# EasyEDA Pro project 贴片练习PCB.epro, board PCB2
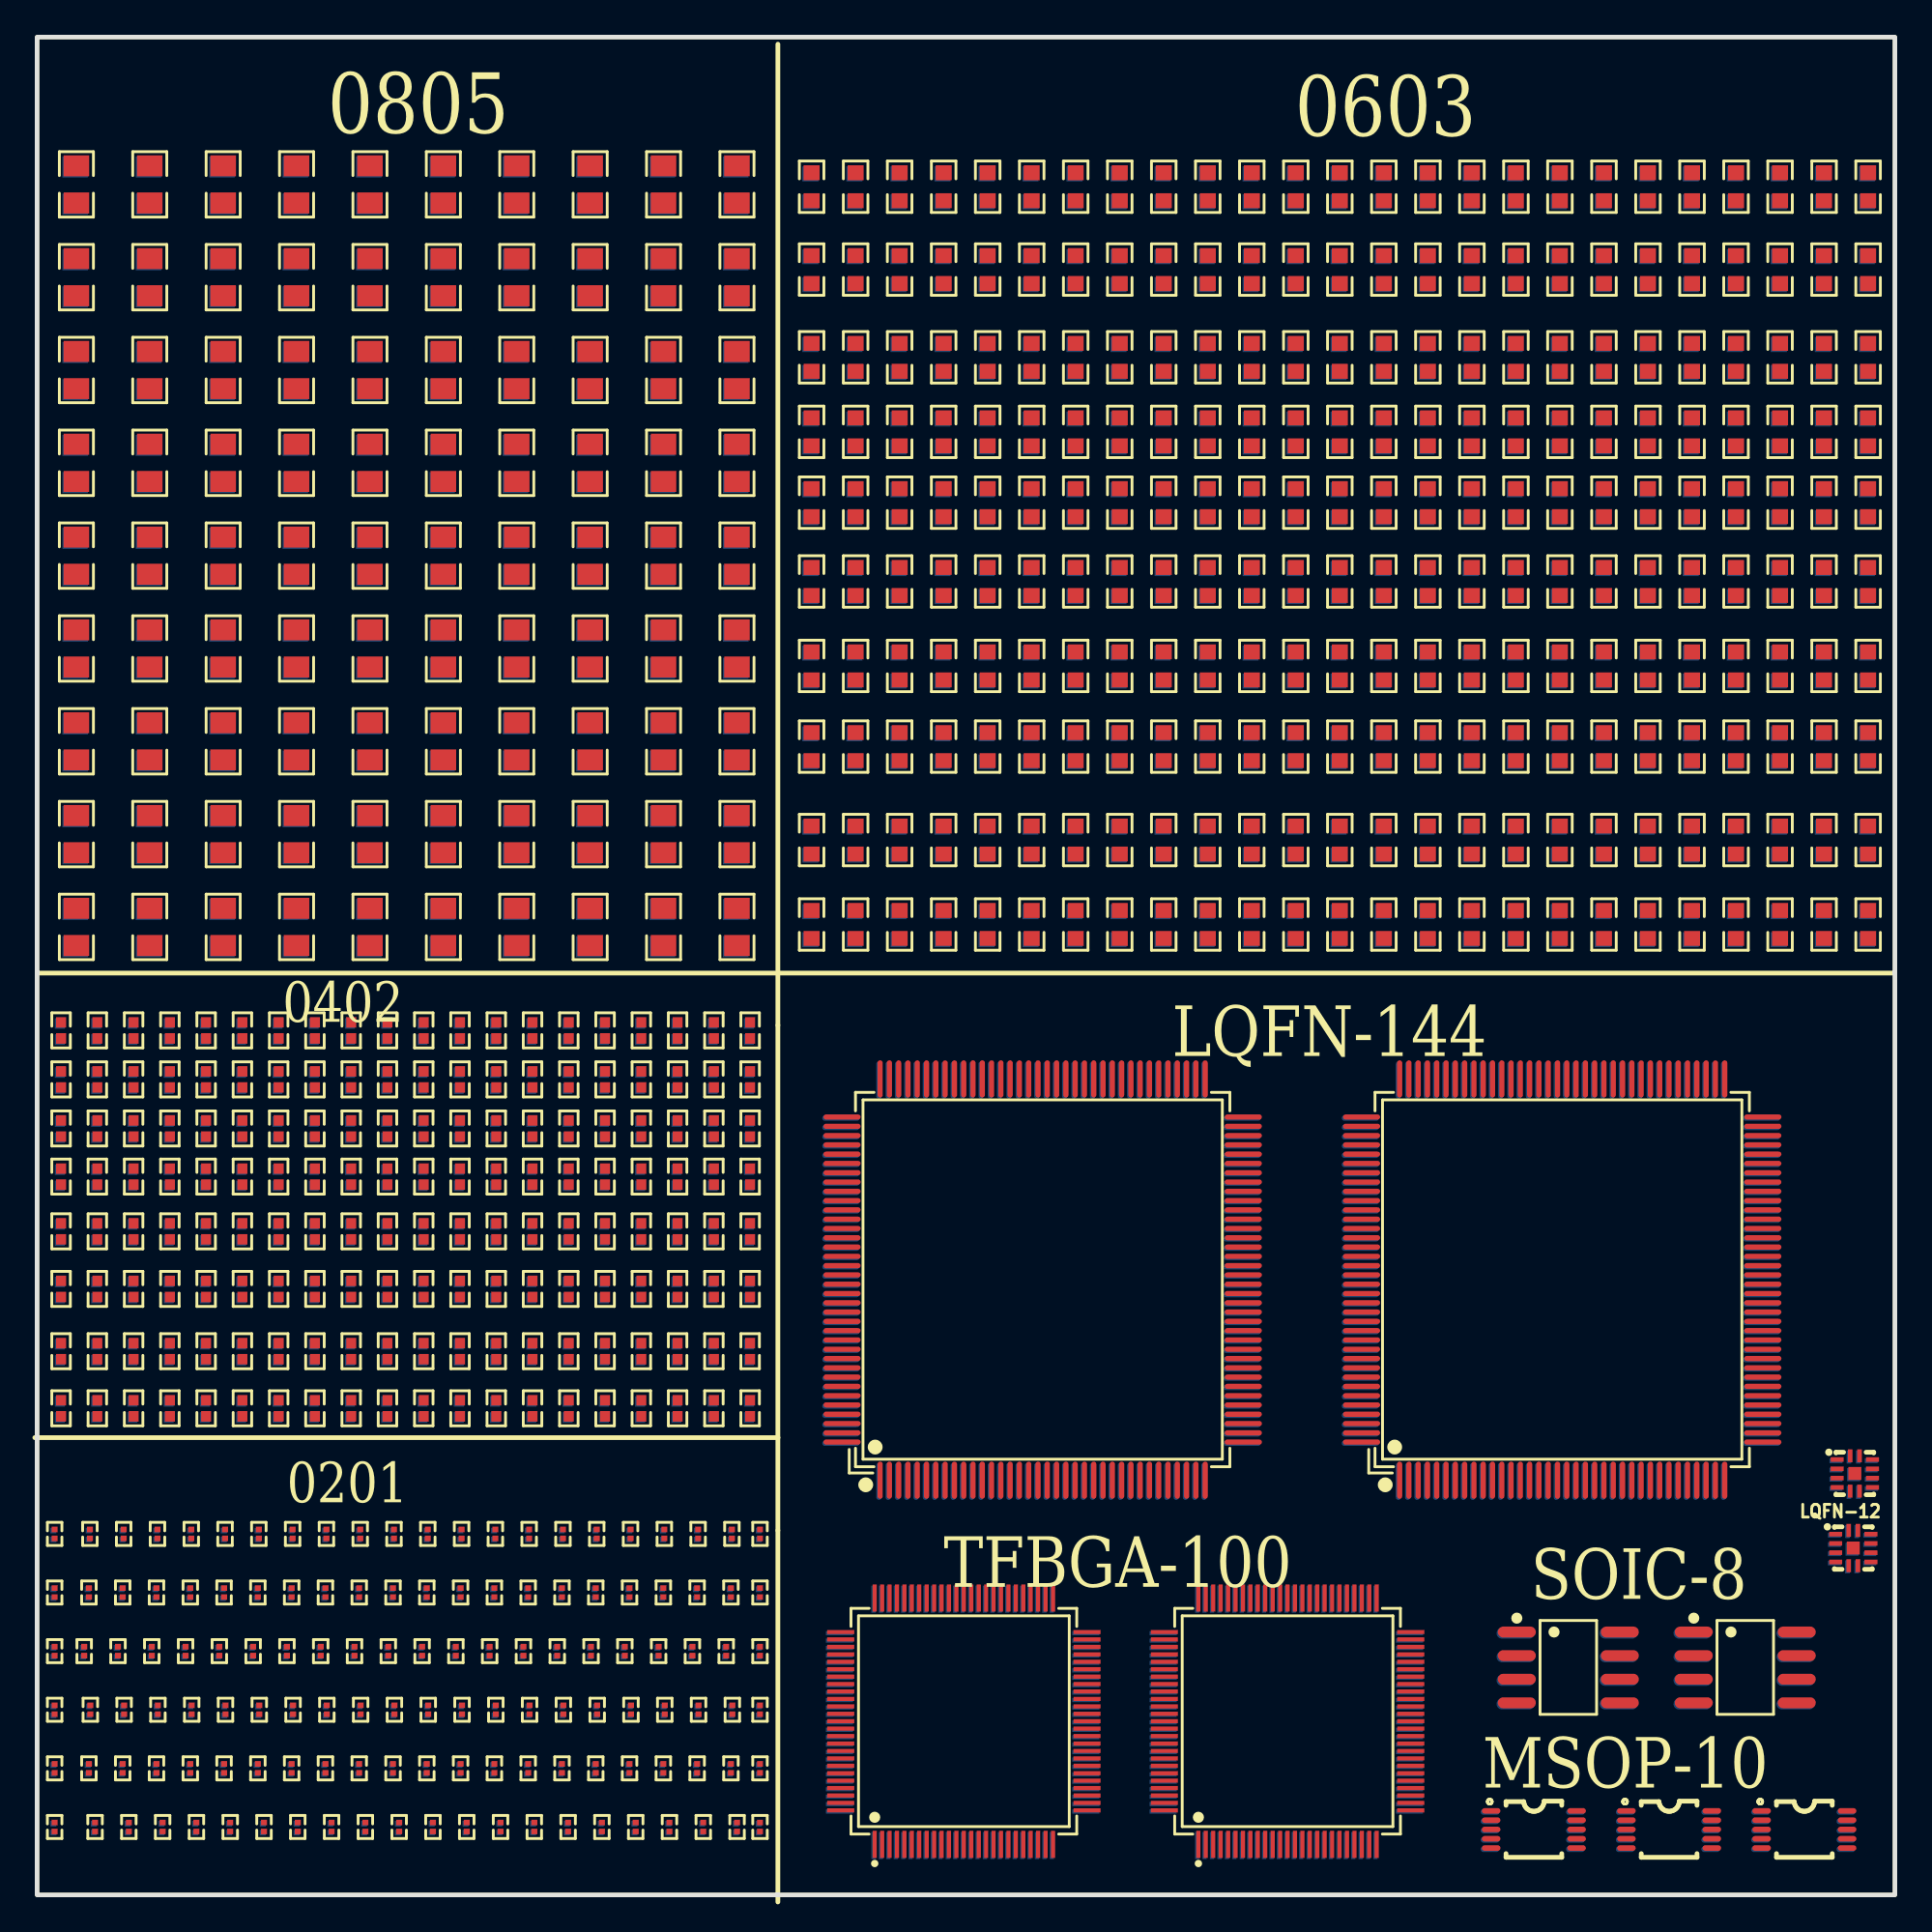
[diagram p1: board, top side]
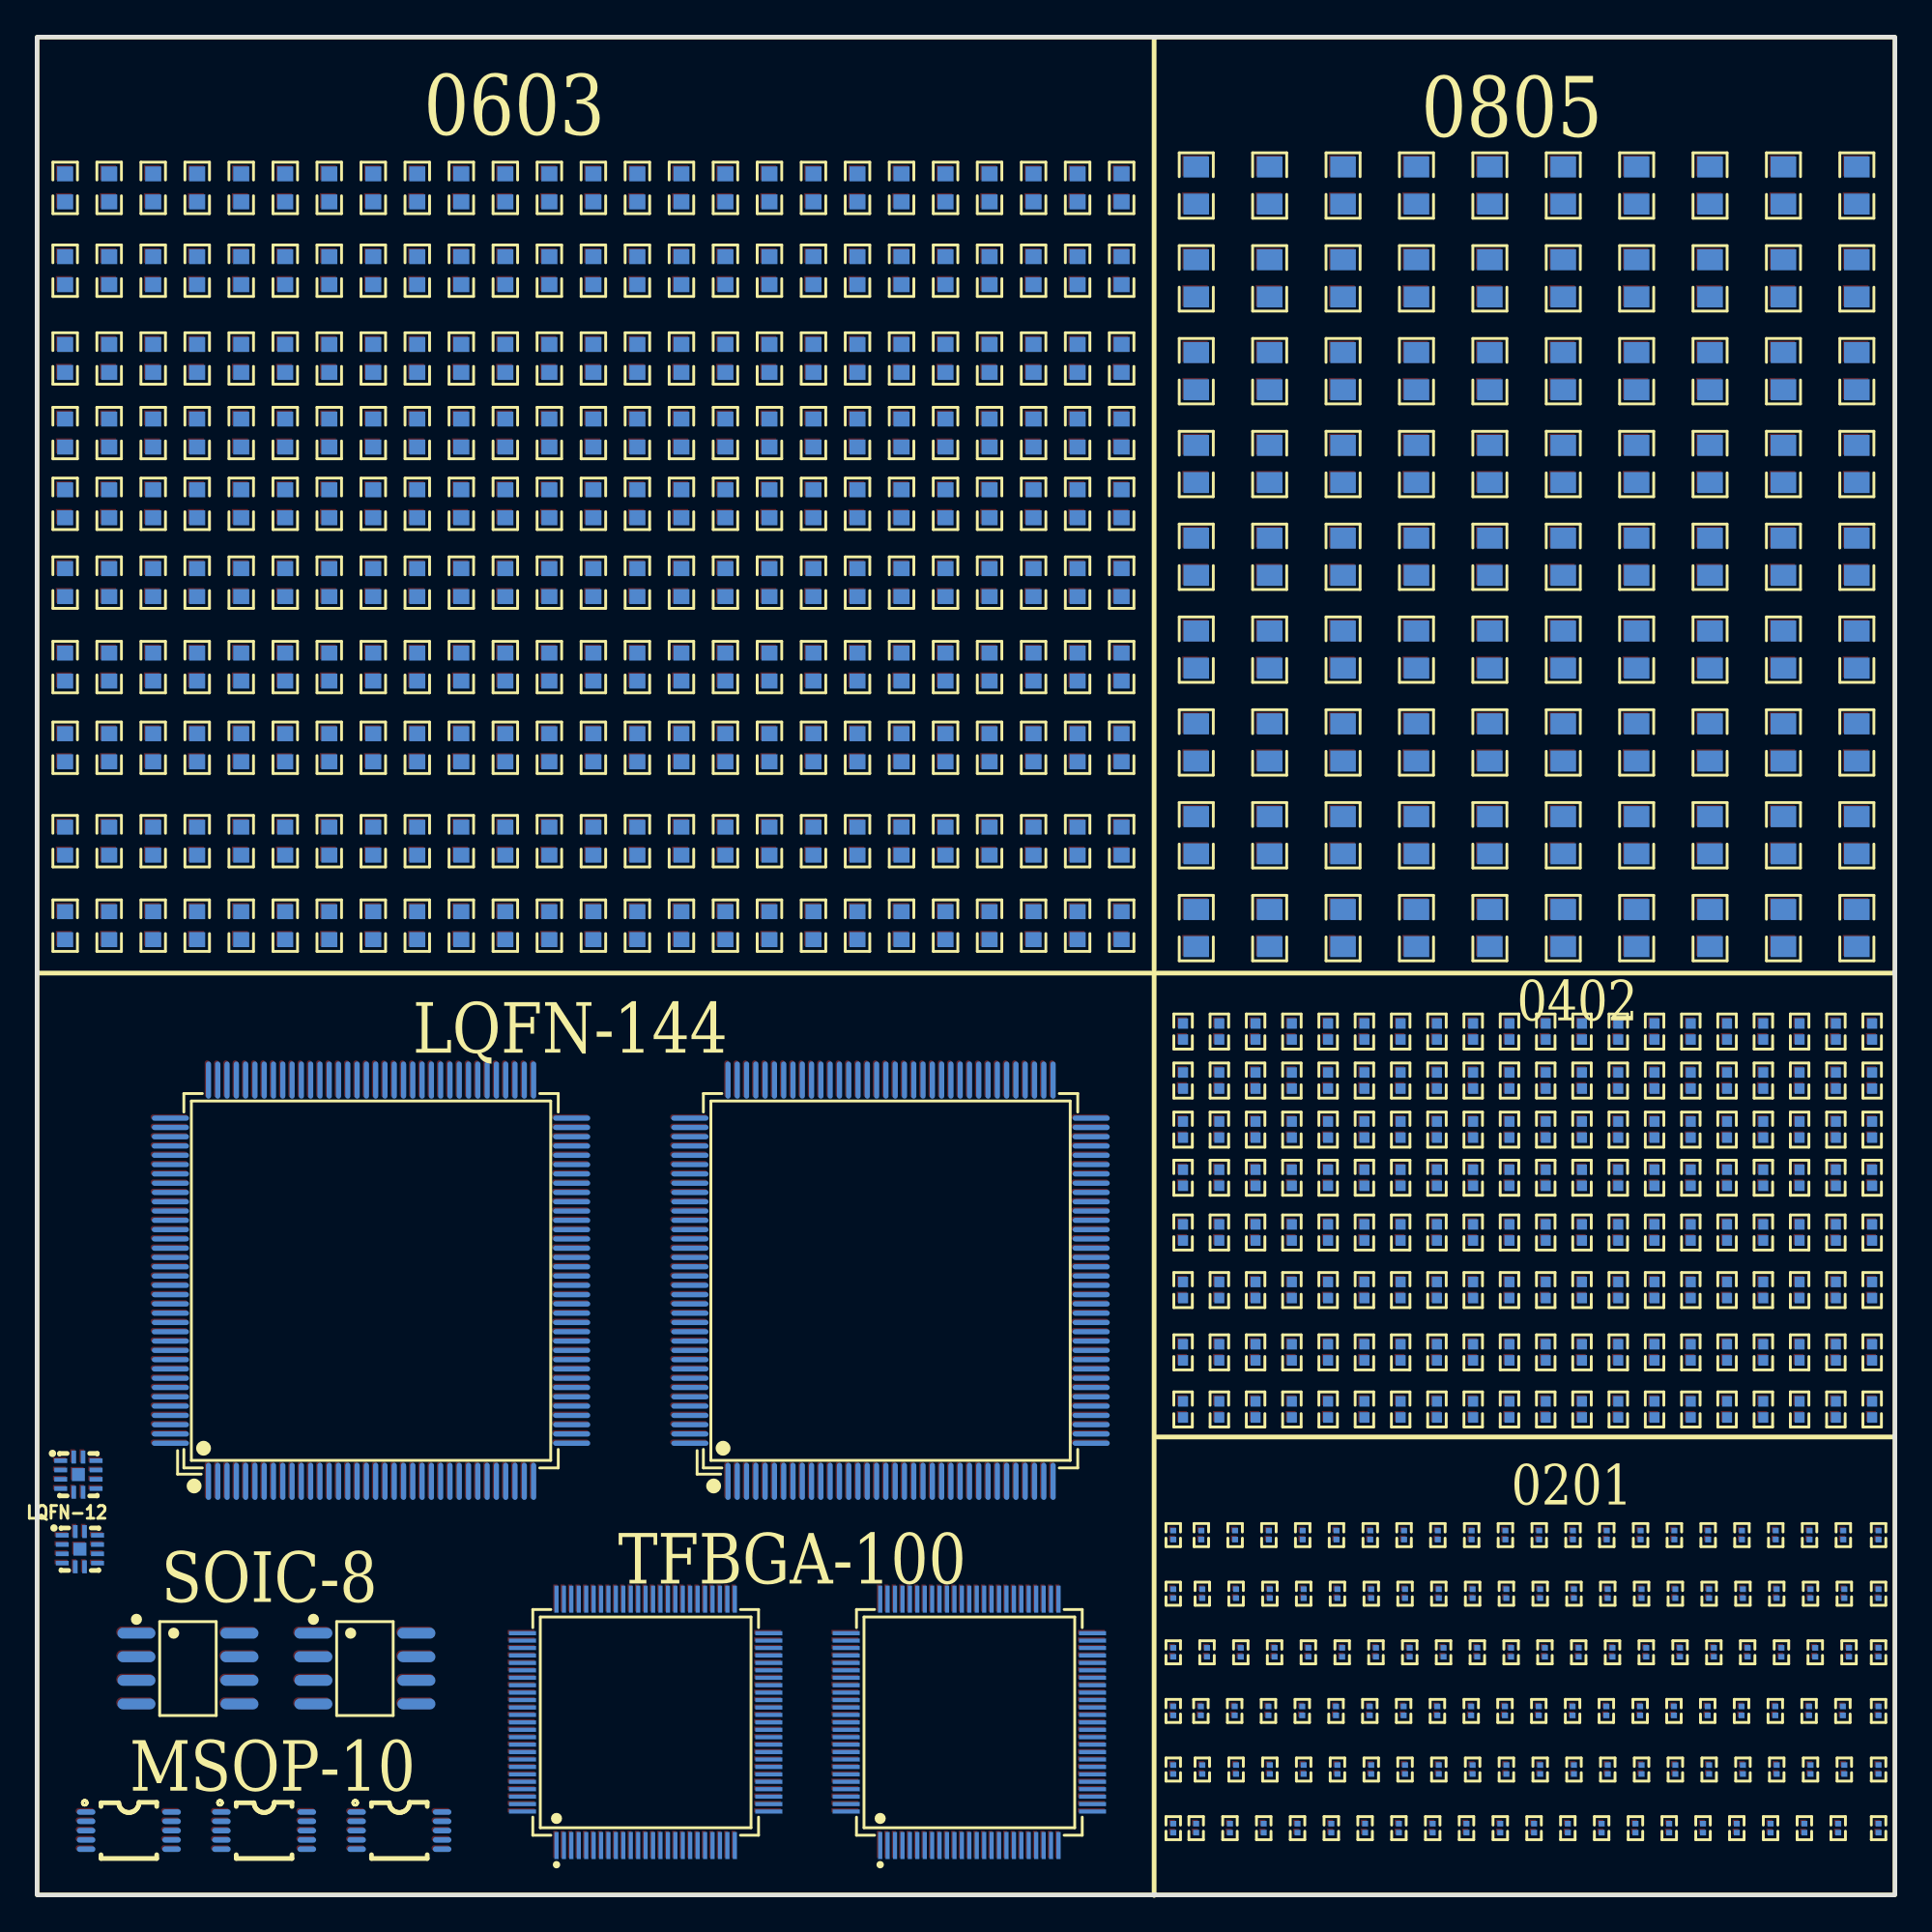
[diagram p2: board, bottom side, seen from below]

Outline 100 x 100 mm; copper layers: Top Layer, Bottom Layer. Coordinates in mm from the lower left corner of the outline.
Outline path: rectangle 0,100 100,0
Stack: Top Layer 0.035mm / Dielectric1 1.51mm FR4 er 4.5 / Bottom Layer 0.035mm

## Design rules (mm)
template: JLCPCB Capability(Two Layers Board)
spacing copperThickness1oz (default): track to track 0.102, other pairs 0.152 to 0.3
spacing copperThickness2oz: track to track 0.203, other pairs 0.152 to 0.3
track width copperThickness1oz (default): min 0.127, default 0.254, max 2.54
track width copperThickness2oz: min 0.203, default 0.254, max 2.54
differential pair differentialPair (default): width min 0.127, default 0.254, max 2.54; gap min 0.152, default 0.152
via viaSize (default): diameter min 0.5, default 0.61, max 10; hole min 0.3, default 0.305, max 6.3

## Placement (name value [footprint] x y rotation side)
LQFN-12  -  [LQFN-12_L2.0-W2.0-P0.50-TL-EP0.7]  97.85 22.68 0 top
LQFN-12#2  -  [LQFN-12_L2.0-W2.0-P0.50-TL-EP0.7]  97.76 18.67 0 top
LQFN-12#3  -  [LQFN-12_L2.0-W2.0-P0.50-TL-EP0.7]  97.7 18.61 180 bottom
LQFN-12#4  -  [LQFN-12_L2.0-W2.0-P0.50-TL-EP0.7]  97.78 22.62 180 bottom
R1  10K  [R0201]  0.94 19.43 90 top
R1#2  -  [R0201]  21.03 19.43 90 top
R1#3  -  [R0201]  0.94 16.27 90 top
R1#4  -  [R0201]  20.98 16.27 90 top
R1#5  -  [R0201]  0.94 13.12 90 top
R1#6  -  [R0201]  20.72 13.12 90 top
R1#7  -  [R0201]  0.94 9.96 90 top
R1#8  -  [R0201]  21.05 9.96 90 top
R1#9  -  [R0201]  0.94 6.81 90 top
R1#10  -  [R0201]  20.98 6.81 90 top
R1#11  -  [R0201]  0.94 3.65 90 top
R1#12  -  [R0201]  21.31 3.65 90 top
R1#13  -  [R0201]  20.99 9.9 90 bottom
R1#14  -  [R0201]  20.66 13.06 90 bottom
R1#15  -  [R0201]  0.88 13.06 90 bottom
R1#16  -  [R0201]  0.88 19.37 90 bottom
R1#17  -  [R0201]  0.88 16.21 90 bottom
R1#18  -  [R0201]  0.88 3.59 90 bottom
R1#19  -  [R0201]  21.24 3.59 90 bottom
R1#20  -  [R0201]  0.88 6.75 90 bottom
R1#21  -  [R0201]  0.88 9.9 90 bottom
R1#22  -  [R0201]  20.96 19.37 90 bottom
R1#23  -  [R0201]  20.91 6.75 90 bottom
R1#24  -  [R0201]  20.91 16.21 90 bottom
R2  10K  [R0201]  4.66 19.43 90 top
R2#2  -  [R0201]  24.67 19.43 90 top
R2#3  -  [R0201]  4.61 16.27 90 top
R2#4  -  [R0201]  24.61 16.27 90 top
R2#5  -  [R0201]  4.35 13.12 90 top
R2#6  -  [R0201]  24.36 13.12 90 top
R2#7  -  [R0201]  4.68 9.96 90 top
R2#8  -  [R0201]  24.69 9.96 90 top
R2#9  -  [R0201]  4.61 6.81 90 top
R2#10  -  [R0201]  24.61 6.81 90 top
R2#11  -  [R0201]  4.94 3.65 90 top
R2#12  -  [R0201]  24.94 3.65 90 top
R2#13  -  [R0201]  4.62 9.9 90 bottom
R2#14  -  [R0201]  4.29 13.06 90 bottom
R2#15  -  [R0201]  24.29 13.06 90 bottom
R2#16  -  [R0201]  4.54 16.21 90 bottom
R2#17  -  [R0201]  24.55 6.75 90 bottom
R2#18  -  [R0201]  4.87 3.59 90 bottom
R2#19  -  [R0201]  24.88 3.59 90 bottom
R2#20  -  [R0201]  24.6 19.37 90 bottom
R2#21  -  [R0201]  4.59 19.37 90 bottom
R2#22  -  [R0201]  24.62 9.9 90 bottom
R2#23  -  [R0201]  4.54 6.75 90 bottom
R2#24  -  [R0201]  24.55 16.21 90 bottom
R3  10K  [R0201]  8.3 19.43 90 top
R3#2  -  [R0201]  28.3 19.43 90 top
R3#3  -  [R0201]  8.24 16.27 90 top
R3#4  -  [R0201]  28.25 16.27 90 top
R3#5  -  [R0201]  7.99 13.12 90 top
R3#6  -  [R0201]  28 13.12 90 top
R3#7  -  [R0201]  8.32 9.96 90 top
R3#8  -  [R0201]  28.33 9.96 90 top
R3#9  -  [R0201]  8.24 6.81 90 top
R3#10  -  [R0201]  28.25 6.81 90 top
R3#11  -  [R0201]  8.57 3.65 90 top
R3#12  -  [R0201]  28.58 3.65 90 top
R3#13  -  [R0201]  28.19 6.75 90 bottom
R3#14  -  [R0201]  7.92 13.06 90 bottom
R3#15  -  [R0201]  8.25 9.9 90 bottom
R3#16  -  [R0201]  27.93 13.06 90 bottom
R3#17  -  [R0201]  8.18 16.21 90 bottom
R3#18  -  [R0201]  8.51 3.59 90 bottom
R3#19  -  [R0201]  8.23 19.37 90 bottom
R3#20  -  [R0201]  28.24 19.37 90 bottom
R3#21  -  [R0201]  28.52 3.59 90 bottom
R3#22  -  [R0201]  28.26 9.9 90 bottom
R3#23  -  [R0201]  8.18 6.75 90 bottom
R3#24  -  [R0201]  28.19 16.21 90 bottom
R4  10K  [R0201]  11.93 19.43 90 top
R4#2  -  [R0201]  33.76 19.43 90 top
R4#3  -  [R0201]  11.88 16.27 90 top
R4#4  -  [R0201]  33.71 16.27 90 top
R4#5  -  [R0201]  11.63 13.12 90 top
R4#6  -  [R0201]  33.45 13.12 90 top
R4#7  -  [R0201]  11.96 9.96 90 top
R4#8  -  [R0201]  33.78 9.96 90 top
R4#9  -  [R0201]  11.88 6.81 90 top
R4#10  -  [R0201]  33.71 6.81 90 top
R4#11  -  [R0201]  12.21 3.65 90 top
R4#12  -  [R0201]  34.04 3.65 90 top
R4#13  -  [R0201]  33.72 9.9 90 bottom
R4#14  -  [R0201]  33.64 6.75 90 bottom
R4#15  -  [R0201]  33.39 13.06 90 bottom
R4#16  -  [R0201]  11.89 9.9 90 bottom
R4#17  -  [R0201]  11.56 13.06 90 bottom
R4#18  -  [R0201]  33.69 19.37 90 bottom
R4#19  -  [R0201]  11.87 19.37 90 bottom
R4#20  -  [R0201]  12.15 3.59 90 bottom
R4#21  -  [R0201]  33.97 3.59 90 bottom
R4#22  -  [R0201]  11.81 6.75 90 bottom
R4#23  -  [R0201]  33.64 16.21 90 bottom
R4#24  -  [R0201]  11.81 16.21 90 bottom
R5  10K  [R0201]  17.34 16.27 90 top
R5#2  -  [R0201]  35.58 19.43 90 top
R5#3  -  [R0201]  17.39 19.43 90 top
R5#4  -  [R0201]  35.53 16.27 90 top
R5#5  -  [R0201]  17.08 13.12 90 top
R5#6  -  [R0201]  35.27 13.12 90 top
R5#7  -  [R0201]  17.41 9.96 90 top
R5#8  -  [R0201]  35.6 9.96 90 top
R5#9  -  [R0201]  17.34 6.81 90 top
R5#10  -  [R0201]  35.53 6.81 90 top
R5#11  -  [R0201]  17.67 3.65 90 top
R5#12  -  [R0201]  35.86 3.65 90 top
R5#13  -  [R0201]  35.46 6.75 90 bottom
R5#14  -  [R0201]  17.02 13.06 90 bottom
R5#15  -  [R0201]  35.54 9.9 90 bottom
R5#16  -  [R0201]  35.51 19.37 90 bottom
R5#17  -  [R0201]  17.32 19.37 90 bottom
R5#18  -  [R0201]  17.6 3.59 90 bottom
R5#19  -  [R0201]  35.79 3.59 90 bottom
R5#20  -  [R0201]  35.21 13.06 90 bottom
R5#21  -  [R0201]  17.35 9.9 90 bottom
R5#22  -  [R0201]  17.27 6.75 90 bottom
R5#23  -  [R0201]  17.27 16.21 90 bottom
R5#24  -  [R0201]  35.46 16.21 90 bottom
R6  10K  [R0201]  38.91 19.43 90 top
R6#2  -  [R0201]  15.52 16.27 90 top
R6#3  -  [R0201]  38.91 16.27 90 top
R6#4  -  [R0201]  15.27 13.12 90 top
R6#5  -  [R0201]  38.91 13.12 90 top
R6#6  -  [R0201]  15.59 9.96 90 top
R6#7  -  [R0201]  15.57 19.43 90 top
R6#8  -  [R0201]  38.91 9.96 90 top
R6#9  -  [R0201]  15.52 6.81 90 top
R6#10  -  [R0201]  38.91 6.81 90 top
R6#11  -  [R0201]  15.85 3.65 90 top
R6#12  -  [R0201]  38.91 3.65 90 top
R6#13  -  [R0201]  38.84 6.75 90 bottom
R6#14  -  [R0201]  15.53 9.9 90 bottom
R6#15  -  [R0201]  15.2 13.06 90 bottom
R6#16  -  [R0201]  38.84 13.06 90 bottom
R6#17  -  [R0201]  15.51 19.37 90 bottom
R6#18  -  [R0201]  38.84 19.37 90 bottom
R6#19  -  [R0201]  15.78 3.59 90 bottom
R6#20  -  [R0201]  38.84 3.59 90 bottom
R6#21  -  [R0201]  38.84 9.9 90 bottom
R6#22  -  [R0201]  15.45 6.75 90 bottom
R6#23  -  [R0201]  15.45 16.21 90 bottom
R6#24  -  [R0201]  38.84 16.21 90 bottom
R7  10K  [R0201]  30.12 19.43 90 top
R7#2  -  [R0201]  19.16 16.27 90 top
R7#3  -  [R0201]  30.07 16.27 90 top
R7#4  -  [R0201]  18.9 13.12 90 top
R7#5  -  [R0201]  29.82 13.12 90 top
R7#6  -  [R0201]  19.23 9.96 90 top
R7#7  -  [R0201]  30.15 9.96 90 top
R7#8  -  [R0201]  19.16 6.81 90 top
R7#9  -  [R0201]  30.07 6.81 90 top
R7#10  -  [R0201]  19.49 3.65 90 top
R7#11  -  [R0201]  19.21 19.43 90 top
R7#12  -  [R0201]  30.4 3.65 90 top
R7#13  -  [R0201]  30.08 9.9 90 bottom
R7#14  -  [R0201]  29.75 13.06 90 bottom
R7#15  -  [R0201]  30 6.75 90 bottom
R7#16  -  [R0201]  18.84 13.06 90 bottom
R7#17  -  [R0201]  30.06 19.37 90 bottom
R7#18  -  [R0201]  19.14 19.37 90 bottom
R7#19  -  [R0201]  19.42 3.59 90 bottom
R7#20  -  [R0201]  30.33 3.59 90 bottom
R7#21  -  [R0201]  19.17 9.9 90 bottom
R7#22  -  [R0201]  19.09 6.75 90 bottom
R7#23  -  [R0201]  30 16.21 90 bottom
R7#24  -  [R0201]  19.09 16.21 90 bottom
R8  10K  [R0201]  22.85 19.43 90 top
R8#2  -  [R0201]  2.79 16.27 90 top
R8#3  -  [R0201]  22.79 16.27 90 top
R8#4  -  [R0201]  2.53 13.12 90 top
R8#5  -  [R0201]  22.54 13.12 90 top
R8#6  -  [R0201]  2.86 9.96 90 top
R8#7  -  [R0201]  22.87 9.96 90 top
R8#8  -  [R0201]  2.79 6.81 90 top
R8#9  -  [R0201]  22.79 6.81 90 top
R8#10  -  [R0201]  3.12 3.65 90 top
R8#11  -  [R0201]  23.12 3.65 90 top
R8#12  -  [R0201]  2.84 19.43 90 top
R8#13  -  [R0201]  2.47 13.06 90 bottom
R8#14  -  [R0201]  22.73 6.75 90 bottom
R8#15  -  [R0201]  2.8 9.9 90 bottom
R8#16  -  [R0201]  23.06 3.59 90 bottom
R8#17  -  [R0201]  22.78 19.37 90 bottom
R8#18  -  [R0201]  3.05 3.59 90 bottom
R8#19  -  [R0201]  2.77 19.37 90 bottom
R8#20  -  [R0201]  22.8 9.9 90 bottom
R8#21  -  [R0201]  2.72 6.75 90 bottom
R8#22  -  [R0201]  22.47 13.06 90 bottom
R8#23  -  [R0201]  2.72 16.21 90 bottom
R8#24  -  [R0201]  22.73 16.21 90 bottom
R9  10K  [R0201]  26.48 19.43 90 top
R9#2  -  [R0201]  6.42 16.27 90 top
R9#3  -  [R0201]  26.43 16.27 90 top
R9#4  -  [R0201]  6.17 13.12 90 top
R9#5  -  [R0201]  26.18 13.12 90 top
R9#6  -  [R0201]  6.5 9.96 90 top
R9#7  -  [R0201]  26.51 9.96 90 top
R9#8  -  [R0201]  6.42 6.81 90 top
R9#9  -  [R0201]  26.43 6.81 90 top
R9#10  -  [R0201]  6.75 3.65 90 top
R9#11  -  [R0201]  26.76 3.65 90 top
R9#12  -  [R0201]  6.48 19.43 90 top
R9#13  -  [R0201]  6.36 16.21 90 bottom
R9#14  -  [R0201]  6.1 13.06 90 bottom
R9#15  -  [R0201]  26.11 13.06 90 bottom
R9#16  -  [R0201]  26.37 6.75 90 bottom
R9#17  -  [R0201]  6.43 9.9 90 bottom
R9#18  -  [R0201]  6.69 3.59 90 bottom
R9#19  -  [R0201]  26.42 19.37 90 bottom
R9#20  -  [R0201]  26.7 3.59 90 bottom
R9#21  -  [R0201]  6.41 19.37 90 bottom
R9#22  -  [R0201]  26.44 9.9 90 bottom
R9#23  -  [R0201]  6.36 6.75 90 bottom
R9#24  -  [R0201]  26.37 16.21 90 bottom
R10  10K  [R0201]  31.94 19.43 90 top
R10#2  -  [R0201]  10.06 16.27 90 top
R10#3  -  [R0201]  31.89 16.27 90 top
R10#4  -  [R0201]  9.81 13.12 90 top
R10#5  -  [R0201]  31.64 13.12 90 top
R10#6  -  [R0201]  10.14 9.96 90 top
R10#7  -  [R0201]  31.97 9.96 90 top
R10#8  -  [R0201]  10.06 6.81 90 top
R10#9  -  [R0201]  31.89 6.81 90 top
R10#10  -  [R0201]  10.39 3.65 90 top
R10#11  -  [R0201]  32.22 3.65 90 top
R10#12  -  [R0201]  10.12 19.43 90 top
R10#13  -  [R0201]  31.9 9.9 90 bottom
R10#14  -  [R0201]  9.74 13.06 90 bottom
R10#15  -  [R0201]  31.57 13.06 90 bottom
R10#16  -  [R0201]  10 16.21 90 bottom
R10#17  -  [R0201]  31.82 6.75 90 bottom
R10#18  -  [R0201]  10.07 9.9 90 bottom
R10#19  -  [R0201]  31.88 19.37 90 bottom
R10#20  -  [R0201]  10.05 19.37 90 bottom
R10#21  -  [R0201]  10.33 3.59 90 bottom
R10#22  -  [R0201]  32.15 3.59 90 bottom
R10#23  -  [R0201]  10 6.75 90 bottom
R10#24  -  [R0201]  31.82 16.21 90 bottom
R11  10K  [R0201]  37.4 19.43 90 top
R11#2  -  [R0201]  13.7 16.27 90 top
R11#3  -  [R0201]  37.35 16.27 90 top
R11#4  -  [R0201]  13.45 13.12 90 top
R11#5  -  [R0201]  37.09 13.12 90 top
R11#6  -  [R0201]  13.78 9.96 90 top
R11#7  -  [R0201]  37.42 9.96 90 top
R11#8  -  [R0201]  13.7 6.81 90 top
R11#9  -  [R0201]  37.35 6.81 90 top
R11#10  -  [R0201]  14.03 3.65 90 top
R11#11  -  [R0201]  37.68 3.65 90 top
R11#12  -  [R0201]  13.75 19.43 90 top
R11#13  -  [R0201]  37.28 6.75 90 bottom
R11#14  -  [R0201]  13.71 9.9 90 bottom
R11#15  -  [R0201]  37.36 9.9 90 bottom
R11#16  -  [R0201]  13.38 13.06 90 bottom
R11#17  -  [R0201]  37.33 19.37 90 bottom
R11#18  -  [R0201]  13.69 19.37 90 bottom
R11#19  -  [R0201]  13.96 3.59 90 bottom
R11#20  -  [R0201]  37.61 3.59 90 bottom
R11#21  -  [R0201]  13.63 6.75 90 bottom
R11#22  -  [R0201]  37.03 13.06 90 bottom
R11#23  -  [R0201]  13.63 16.21 90 bottom
R11#24  -  [R0201]  37.28 16.21 90 bottom
R12  10K  [R0402]  20.81 38.66 90 top
R12#2  -  [R0402]  20.81 46.53 90 top
R12#3  -  [R0402]  20.81 43.9 90 top
R12#4  -  [R0402]  3.24 43.9 90 top
R12#5  -  [R0402]  20.81 41.25 90 top
R12#6  -  [R0402]  3.24 41.25 90 top
R12#7  -  [R0402]  3.24 38.66 90 top
R12#8  -  [R0402]  20.81 35.72 90 top
R12#9  -  [R0402]  3.24 35.72 90 top
R12#10  -  [R0402]  20.81 32.62 90 top
R12#11  -  [R0402]  3.24 32.62 90 top
R12#12  -  [R0402]  20.81 29.26 90 top
R12#13  -  [R0402]  3.24 29.26 90 top
R12#14  -  [R0402]  20.81 26.19 90 top
R12#15  -  [R0402]  3.24 26.19 90 top
R12#16  -  [R0402]  3.24 46.53 90 top
R12#17  -  [R0402]  20.74 43.83 90 bottom
R12#18  -  [R0402]  20.74 29.2 90 bottom
R12#19  -  [R0402]  20.74 32.56 90 bottom
R12#20  -  [R0402]  3.17 26.13 90 bottom
R12#21  -  [R0402]  20.74 41.19 90 bottom
R12#22  -  [R0402]  20.74 38.6 90 bottom
R12#23  -  [R0402]  20.74 35.65 90 bottom
R12#24  -  [R0402]  20.74 26.13 90 bottom
R12#25  -  [R0402]  20.74 46.47 90 bottom
R12#26  -  [R0402]  3.17 46.47 90 bottom
R12#27  -  [R0402]  3.17 29.2 90 bottom
R12#28  -  [R0402]  3.17 35.65 90 bottom
R12#29  -  [R0402]  3.17 43.83 90 bottom
R12#30  -  [R0402]  3.17 41.19 90 bottom
R12#31  -  [R0402]  3.17 32.56 90 bottom
R12#32  -  [R0402]  3.17 38.6 90 bottom
R13  10K  [R0402]  26.67 46.53 90 top
R13#2  -  [R0402]  7.14 43.9 90 top
R13#3  -  [R0402]  26.67 43.9 90 top
R13#4  -  [R0402]  7.14 41.25 90 top
R13#5  -  [R0402]  26.67 41.25 90 top
R13#6  -  [R0402]  7.14 38.66 90 top
R13#7  -  [R0402]  26.67 38.66 90 top
R13#8  -  [R0402]  7.14 35.72 90 top
R13#9  -  [R0402]  26.67 35.72 90 top
R13#10  -  [R0402]  7.14 32.62 90 top
R13#11  -  [R0402]  26.67 32.62 90 top
R13#12  -  [R0402]  7.14 29.26 90 top
R13#13  -  [R0402]  26.67 29.26 90 top
R13#14  -  [R0402]  7.14 26.19 90 top
R13#15  -  [R0402]  26.67 26.19 90 top
R13#16  -  [R0402]  7.14 46.53 90 top
R13#17  -  [R0402]  7.08 29.2 90 bottom
R13#18  -  [R0402]  7.08 32.56 90 bottom
R13#19  -  [R0402]  7.08 43.83 90 bottom
R13#20  -  [R0402]  7.08 26.13 90 bottom
R13#21  -  [R0402]  7.08 38.6 90 bottom
R13#22  -  [R0402]  7.08 35.65 90 bottom
R13#23  -  [R0402]  7.08 41.19 90 bottom
R13#24  -  [R0402]  7.08 46.47 90 bottom
R13#25  -  [R0402]  26.6 32.56 90 bottom
R13#26  -  [R0402]  26.6 26.13 90 bottom
R13#27  -  [R0402]  26.6 46.47 90 bottom
R13#28  -  [R0402]  26.6 29.2 90 bottom
R13#29  -  [R0402]  26.6 38.6 90 bottom
R13#30  -  [R0402]  26.6 35.65 90 bottom
R13#31  -  [R0402]  26.6 43.83 90 bottom
R13#32  -  [R0402]  26.6 41.19 90 bottom
R14  10K  [R0402]  30.57 46.53 90 top
R14#2  -  [R0402]  11.05 43.9 90 top
R14#3  -  [R0402]  30.57 43.9 90 top
R14#4  -  [R0402]  11.05 41.25 90 top
R14#5  -  [R0402]  30.57 41.25 90 top
R14#6  -  [R0402]  11.05 38.66 90 top
R14#7  -  [R0402]  30.57 38.66 90 top
R14#8  -  [R0402]  11.05 35.72 90 top
R14#9  -  [R0402]  30.57 35.72 90 top
R14#10  -  [R0402]  11.05 32.62 90 top
R14#11  -  [R0402]  30.57 32.62 90 top
R14#12  -  [R0402]  11.05 29.26 90 top
R14#13  -  [R0402]  30.57 29.26 90 top
R14#14  -  [R0402]  11.05 26.19 90 top
R14#15  -  [R0402]  30.57 26.19 90 top
R14#16  -  [R0402]  11.05 46.53 90 top
R14#17  -  [R0402]  30.51 43.83 90 bottom
R14#18  -  [R0402]  10.98 38.6 90 bottom
R14#19  -  [R0402]  10.98 29.2 90 bottom
R14#20  -  [R0402]  30.51 46.47 90 bottom
R14#21  -  [R0402]  30.51 32.56 90 bottom
R14#22  -  [R0402]  30.51 29.2 90 bottom
R14#23  -  [R0402]  30.51 26.13 90 bottom
R14#24  -  [R0402]  10.98 46.47 90 bottom
R14#25  -  [R0402]  10.98 26.13 90 bottom
R14#26  -  [R0402]  10.98 41.19 90 bottom
R14#27  -  [R0402]  10.98 32.56 90 bottom
R14#28  -  [R0402]  10.98 35.65 90 bottom
R14#29  -  [R0402]  10.98 43.83 90 bottom
R14#30  -  [R0402]  30.51 41.19 90 bottom
R14#31  -  [R0402]  30.51 38.6 90 bottom
R14#32  -  [R0402]  30.51 35.65 90 bottom
R15  10K  [R0402]  34.48 32.62 90 top
R15#2  -  [R0402]  34.48 46.53 90 top
R15#3  -  [R0402]  14.95 43.9 90 top
R15#4  -  [R0402]  34.48 43.9 90 top
R15#5  -  [R0402]  14.95 41.25 90 top
R15#6  -  [R0402]  34.48 41.25 90 top
R15#7  -  [R0402]  14.95 38.66 90 top
R15#8  -  [R0402]  34.48 38.66 90 top
R15#9  -  [R0402]  14.95 35.72 90 top
R15#10  -  [R0402]  34.48 35.72 90 top
R15#11  -  [R0402]  14.95 32.62 90 top
R15#12  -  [R0402]  14.95 29.26 90 top
R15#13  -  [R0402]  34.48 29.26 90 top
R15#14  -  [R0402]  14.95 26.19 90 top
R15#15  -  [R0402]  34.48 26.19 90 top
R15#16  -  [R0402]  14.95 46.53 90 top
R15#17  -  [R0402]  14.89 35.65 90 bottom
R15#18  -  [R0402]  14.89 41.19 90 bottom
R15#19  -  [R0402]  14.89 43.83 90 bottom
R15#20  -  [R0402]  14.89 29.2 90 bottom
R15#21  -  [R0402]  14.89 32.56 90 bottom
R15#22  -  [R0402]  34.41 46.47 90 bottom
R15#23  -  [R0402]  34.41 43.83 90 bottom
R15#24  -  [R0402]  34.41 26.13 90 bottom
R15#25  -  [R0402]  14.89 46.47 90 bottom
R15#26  -  [R0402]  14.89 26.13 90 bottom
R15#27  -  [R0402]  14.89 38.6 90 bottom
R15#28  -  [R0402]  34.41 32.56 90 bottom
R15#29  -  [R0402]  34.41 29.2 90 bottom
R15#30  -  [R0402]  34.41 35.65 90 bottom
R15#31  -  [R0402]  34.41 38.6 90 bottom
R15#32  -  [R0402]  34.41 41.19 90 bottom
R16  10K  [R0402]  36.43 38.66 90 top
R16#2  -  [R0402]  36.43 46.53 90 top
R16#3  -  [R0402]  16.91 43.9 90 top
R16#4  -  [R0402]  36.43 43.9 90 top
R16#5  -  [R0402]  16.91 41.25 90 top
R16#6  -  [R0402]  36.43 41.25 90 top
R16#7  -  [R0402]  16.91 38.66 90 top
R16#8  -  [R0402]  16.91 35.72 90 top
R16#9  -  [R0402]  36.43 35.72 90 top
R16#10  -  [R0402]  16.91 32.62 90 top
R16#11  -  [R0402]  36.43 32.62 90 top
R16#12  -  [R0402]  16.91 29.26 90 top
R16#13  -  [R0402]  36.43 29.26 90 top
R16#14  -  [R0402]  16.91 26.19 90 top
R16#15  -  [R0402]  36.43 26.19 90 top
R16#16  -  [R0402]  16.91 46.53 90 top
R16#17  -  [R0402]  16.84 32.56 90 bottom
R16#18  -  [R0402]  16.84 41.19 90 bottom
R16#19  -  [R0402]  16.84 38.6 90 bottom
R16#20  -  [R0402]  16.84 46.47 90 bottom
R16#21  -  [R0402]  16.84 43.83 90 bottom
R16#22  -  [R0402]  36.36 46.47 90 bottom
R16#23  -  [R0402]  36.36 41.19 90 bottom
R16#24  -  [R0402]  36.36 38.6 90 bottom
R16#25  -  [R0402]  36.36 43.83 90 bottom
R16#26  -  [R0402]  36.36 32.56 90 bottom
R16#27  -  [R0402]  36.36 29.2 90 bottom
R16#28  -  [R0402]  36.36 26.13 90 bottom
R16#29  -  [R0402]  16.84 35.65 90 bottom
R16#30  -  [R0402]  16.84 29.2 90 bottom
R16#31  -  [R0402]  16.84 26.13 90 bottom
R16#32  -  [R0402]  36.36 35.65 90 bottom
R17  10K  [R0402]  38.38 46.53 90 top
R17#2  -  [R0402]  18.86 43.9 90 top
R17#3  -  [R0402]  38.38 43.9 90 top
R17#4  -  [R0402]  18.86 41.25 90 top
R17#5  -  [R0402]  38.38 41.25 90 top
R17#6  -  [R0402]  18.86 38.66 90 top
R17#7  -  [R0402]  38.38 38.66 90 top
R17#8  -  [R0402]  18.86 35.72 90 top
R17#9  -  [R0402]  38.38 35.72 90 top
R17#10  -  [R0402]  18.86 32.62 90 top
R17#11  -  [R0402]  38.38 32.62 90 top
R17#12  -  [R0402]  18.86 29.26 90 top
R17#13  -  [R0402]  38.38 29.26 90 top
R17#14  -  [R0402]  18.86 26.19 90 top
R17#15  -  [R0402]  38.38 26.19 90 top
R17#16  -  [R0402]  18.86 46.53 90 top
R17#17  -  [R0402]  18.79 38.6 90 bottom
R17#18  -  [R0402]  18.79 35.65 90 bottom
R17#19  -  [R0402]  18.79 32.56 90 bottom
R17#20  -  [R0402]  38.31 29.2 90 bottom
R17#21  -  [R0402]  38.31 35.65 90 bottom
R17#22  -  [R0402]  38.31 41.19 90 bottom
R17#23  -  [R0402]  38.31 38.6 90 bottom
R17#24  -  [R0402]  18.79 43.83 90 bottom
R17#25  -  [R0402]  38.31 43.83 90 bottom
R17#26  -  [R0402]  38.31 46.47 90 bottom
R17#27  -  [R0402]  38.31 32.56 90 bottom
R17#28  -  [R0402]  38.31 26.13 90 bottom
R17#29  -  [R0402]  18.79 29.2 90 bottom
R17#30  -  [R0402]  18.79 26.13 90 bottom
R17#31  -  [R0402]  18.79 46.47 90 bottom
R17#32  -  [R0402]  18.79 41.19 90 bottom
R18  10K  [R0402]  22.76 46.53 90 top
R18#2  -  [R0402]  1.29 43.9 90 top
R18#3  -  [R0402]  22.76 43.9 90 top
R18#4  -  [R0402]  1.29 41.25 90 top
R18#5  -  [R0402]  22.76 41.25 90 top
R18#6  -  [R0402]  1.29 38.66 90 top
R18#7  -  [R0402]  22.76 38.66 90 top
R18#8  -  [R0402]  1.29 35.72 90 top
R18#9  -  [R0402]  22.76 35.72 90 top
R18#10  -  [R0402]  1.29 32.62 90 top
R18#11  -  [R0402]  22.76 32.62 90 top
R18#12  -  [R0402]  1.29 29.26 90 top
R18#13  -  [R0402]  22.76 29.26 90 top
R18#14  -  [R0402]  1.29 26.19 90 top
R18#15  -  [R0402]  22.76 26.19 90 top
R18#16  -  [R0402]  1.29 46.53 90 top
R18#17  -  [R0402]  22.7 29.2 90 bottom
R18#18  -  [R0402]  22.7 41.19 90 bottom
R18#19  -  [R0402]  22.7 43.83 90 bottom
R18#20  -  [R0402]  22.7 35.65 90 bottom
R18#21  -  [R0402]  22.7 38.6 90 bottom
R18#22  -  [R0402]  22.7 26.13 90 bottom
R18#23  -  [R0402]  22.7 32.56 90 bottom
R18#24  -  [R0402]  22.7 46.47 90 bottom
R18#25  -  [R0402]  1.22 29.2 90 bottom
R18#26  -  [R0402]  1.22 26.13 90 bottom
R18#27  -  [R0402]  1.22 32.56 90 bottom
R18#28  -  [R0402]  1.22 35.65 90 bottom
R18#29  -  [R0402]  1.22 38.6 90 bottom
R18#30  -  [R0402]  1.22 43.83 90 bottom
R18#31  -  [R0402]  1.22 41.19 90 bottom
R18#32  -  [R0402]  1.22 46.47 90 bottom
R19  10K  [R0402]  24.72 46.53 90 top
R19#2  -  [R0402]  5.19 43.9 90 top
R19#3  -  [R0402]  24.72 43.9 90 top
R19#4  -  [R0402]  5.19 41.25 90 top
R19#5  -  [R0402]  24.72 41.25 90 top
R19#6  -  [R0402]  5.19 38.66 90 top
R19#7  -  [R0402]  24.72 38.66 90 top
R19#8  -  [R0402]  5.19 35.72 90 top
R19#9  -  [R0402]  24.72 35.72 90 top
R19#10  -  [R0402]  5.19 32.62 90 top
R19#11  -  [R0402]  24.72 32.62 90 top
R19#12  -  [R0402]  5.19 29.26 90 top
R19#13  -  [R0402]  24.72 29.26 90 top
R19#14  -  [R0402]  5.19 26.19 90 top
R19#15  -  [R0402]  24.72 26.19 90 top
R19#16  -  [R0402]  5.19 46.53 90 top
R19#17  -  [R0402]  24.65 26.13 90 bottom
R19#18  -  [R0402]  5.13 29.2 90 bottom
R19#19  -  [R0402]  5.13 26.13 90 bottom
R19#20  -  [R0402]  5.13 35.65 90 bottom
R19#21  -  [R0402]  5.13 46.47 90 bottom
R19#22  -  [R0402]  5.13 38.6 90 bottom
R19#23  -  [R0402]  24.65 46.47 90 bottom
R19#24  -  [R0402]  24.65 29.2 90 bottom
R19#25  -  [R0402]  24.65 35.65 90 bottom
R19#26  -  [R0402]  24.65 43.83 90 bottom
R19#27  -  [R0402]  24.65 38.6 90 bottom
R19#28  -  [R0402]  24.65 41.19 90 bottom
R19#29  -  [R0402]  24.65 32.56 90 bottom
R19#30  -  [R0402]  5.13 43.83 90 bottom
R19#31  -  [R0402]  5.13 32.56 90 bottom
R19#32  -  [R0402]  5.13 41.19 90 bottom
R20  10K  [R0402]  28.62 38.66 90 top
R20#2  -  [R0402]  28.62 46.53 90 top
R20#3  -  [R0402]  9.1 43.9 90 top
R20#4  -  [R0402]  28.62 43.9 90 top
R20#5  -  [R0402]  9.1 41.25 90 top
R20#6  -  [R0402]  28.62 41.25 90 top
R20#7  -  [R0402]  9.1 38.66 90 top
R20#8  -  [R0402]  9.1 35.72 90 top
R20#9  -  [R0402]  28.62 35.72 90 top
R20#10  -  [R0402]  9.1 32.62 90 top
R20#11  -  [R0402]  28.62 32.62 90 top
R20#12  -  [R0402]  9.1 29.26 90 top
R20#13  -  [R0402]  28.62 29.26 90 top
R20#14  -  [R0402]  9.1 26.19 90 top
R20#15  -  [R0402]  28.62 26.19 90 top
R20#16  -  [R0402]  9.1 46.53 90 top
R20#17  -  [R0402]  28.55 38.6 90 bottom
R20#18  -  [R0402]  28.55 35.65 90 bottom
R20#19  -  [R0402]  28.55 46.47 90 bottom
R20#20  -  [R0402]  28.55 41.19 90 bottom
R20#21  -  [R0402]  28.55 43.83 90 bottom
R20#22  -  [R0402]  9.03 35.65 90 bottom
R20#23  -  [R0402]  9.03 38.6 90 bottom
R20#24  -  [R0402]  9.03 43.83 90 bottom
R20#25  -  [R0402]  9.03 26.13 90 bottom
R20#26  -  [R0402]  9.03 32.56 90 bottom
R20#27  -  [R0402]  9.03 29.2 90 bottom
R20#28  -  [R0402]  9.03 41.19 90 bottom
R20#29  -  [R0402]  9.03 46.47 90 bottom
R20#30  -  [R0402]  28.55 32.56 90 bottom
R20#31  -  [R0402]  28.55 29.2 90 bottom
R20#32  -  [R0402]  28.55 26.13 90 bottom
R21  10K  [R0402]  32.52 46.53 90 top
R21#2  -  [R0402]  13 43.9 90 top
R21#3  -  [R0402]  32.52 43.9 90 top
R21#4  -  [R0402]  13 41.25 90 top
R21#5  -  [R0402]  32.52 41.25 90 top
R21#6  -  [R0402]  13 38.66 90 top
R21#7  -  [R0402]  32.52 38.66 90 top
R21#8  -  [R0402]  13 35.72 90 top
R21#9  -  [R0402]  32.52 35.72 90 top
R21#10  -  [R0402]  13 32.62 90 top
R21#11  -  [R0402]  32.52 32.62 90 top
R21#12  -  [R0402]  13 29.26 90 top
R21#13  -  [R0402]  32.52 29.26 90 top
R21#14  -  [R0402]  13 26.19 90 top
R21#15  -  [R0402]  32.52 26.19 90 top
R21#16  -  [R0402]  13 46.53 90 top
R21#17  -  [R0402]  32.46 35.65 90 bottom
R21#18  -  [R0402]  12.94 29.2 90 bottom
R21#19  -  [R0402]  12.94 38.6 90 bottom
R21#20  -  [R0402]  12.94 41.19 90 bottom
R21#21  -  [R0402]  12.94 35.65 90 bottom
R21#22  -  [R0402]  12.94 43.83 90 bottom
R21#23  -  [R0402]  32.46 46.47 90 bottom
R21#24  -  [R0402]  32.46 43.83 90 bottom
R21#25  -  [R0402]  32.46 32.56 90 bottom
R21#26  -  [R0402]  32.46 29.2 90 bottom
R21#27  -  [R0402]  32.46 26.13 90 bottom
R21#28  -  [R0402]  12.94 46.47 90 bottom
R21#29  -  [R0402]  12.94 26.13 90 bottom
R21#30  -  [R0402]  12.94 32.56 90 bottom
R21#31  -  [R0402]  32.46 38.6 90 bottom
R21#32  -  [R0402]  32.46 41.19 90 bottom
R22  10K  [R0603]  44.06 82.77 90 top
R22#2  -  [R0603]  67.75 78.75 90 top
R22#3  -  [R0603]  44.06 78.75 90 top
R22#4  -  [R0603]  67.75 74.94 90 top
R22#5  -  [R0603]  44.06 74.94 90 top
R22#6  -  [R0603]  67.75 70.7 90 top
R22#7  -  [R0603]  44.06 70.7 90 top
R22#8  -  [R0603]  67.75 66.15 90 top
R22#9  -  [R0603]  44.06 66.15 90 top
R22#10  -  [R0603]  67.75 61.81 90 top
R22#11  -  [R0603]  44.06 61.81 90 top
R22#12  -  [R0603]  67.75 56.78 90 top
R22#13  -  [R0603]  44.06 56.78 90 top
R22#14  -  [R0603]  67.75 52.23 90 top
R22#15  -  [R0603]  44.06 52.23 90 top
R22#16  -  [R0603]  44.06 91.95 90 top
R22#17  -  [R0603]  67.75 91.95 90 top
R22#18  -  [R0603]  67.75 87.49 90 top
R22#19  -  [R0603]  44.06 87.49 90 top
R22#20  -  [R0603]  67.75 82.77 90 top
R22#21  -  [R0603]  43.99 91.89 90 bottom
R22#22  -  [R0603]  43.99 87.43 90 bottom
R22#23  -  [R0603]  67.69 61.75 90 bottom
R22#24  -  [R0603]  67.69 70.64 90 bottom
R22#25  -  [R0603]  67.69 91.89 90 bottom
R22#26  -  [R0603]  67.69 56.72 90 bottom
R22#27  -  [R0603]  67.69 78.69 90 bottom
R22#28  -  [R0603]  67.69 87.43 90 bottom
R22#29  -  [R0603]  43.99 66.09 90 bottom
R22#30  -  [R0603]  43.99 70.64 90 bottom
R22#31  -  [R0603]  43.99 56.72 90 bottom
R22#32  -  [R0603]  67.69 82.7 90 bottom
R22#33  -  [R0603]  43.99 61.75 90 bottom
R22#34  -  [R0603]  43.99 82.7 90 bottom
R22#35  -  [R0603]  43.99 78.69 90 bottom
R22#36  -  [R0603]  43.99 74.88 90 bottom
R22#37  -  [R0603]  43.99 52.17 90 bottom
R22#38  -  [R0603]  67.69 74.88 90 bottom
R22#39  -  [R0603]  67.69 52.17 90 bottom
R22#40  -  [R0603]  67.69 66.09 90 bottom
R23  10K  [R0603]  72.49 82.77 90 top
R23#2  -  [R0603]  48.8 78.75 90 top
R23#3  -  [R0603]  72.49 78.75 90 top
R23#4  -  [R0603]  48.8 74.94 90 top
R23#5  -  [R0603]  72.49 74.94 90 top
R23#6  -  [R0603]  48.8 70.7 90 top
R23#7  -  [R0603]  72.49 70.7 90 top
R23#8  -  [R0603]  48.8 66.15 90 top
R23#9  -  [R0603]  72.49 66.15 90 top
R23#10  -  [R0603]  48.8 61.81 90 top
R23#11  -  [R0603]  72.49 61.81 90 top
R23#12  -  [R0603]  48.8 56.78 90 top
R23#13  -  [R0603]  72.49 56.78 90 top
R23#14  -  [R0603]  48.8 52.23 90 top
R23#15  -  [R0603]  72.49 52.23 90 top
R23#16  -  [R0603]  48.8 91.95 90 top
R23#17  -  [R0603]  72.49 91.95 90 top
R23#18  -  [R0603]  48.8 87.49 90 top
R23#19  -  [R0603]  72.49 87.49 90 top
R23#20  -  [R0603]  48.8 82.77 90 top
R23#21  -  [R0603]  72.43 70.64 90 bottom
R23#22  -  [R0603]  72.43 66.09 90 bottom
R23#23  -  [R0603]  48.73 91.89 90 bottom
R23#24  -  [R0603]  72.43 91.89 90 bottom
R23#25  -  [R0603]  72.43 87.43 90 bottom
R23#26  -  [R0603]  48.73 87.43 90 bottom
R23#27  -  [R0603]  72.43 78.69 90 bottom
R23#28  -  [R0603]  48.73 78.69 90 bottom
R23#29  -  [R0603]  48.73 74.88 90 bottom
R23#30  -  [R0603]  72.43 82.7 90 bottom
R23#31  -  [R0603]  72.43 74.88 90 bottom
R23#32  -  [R0603]  72.43 52.17 90 bottom
R23#33  -  [R0603]  72.43 56.72 90 bottom
R23#34  -  [R0603]  72.43 61.75 90 bottom
R23#35  -  [R0603]  48.73 52.17 90 bottom
R23#36  -  [R0603]  48.73 61.75 90 bottom
R23#37  -  [R0603]  48.73 82.7 90 bottom
R23#38  -  [R0603]  48.73 66.09 90 bottom
R23#39  -  [R0603]  48.73 70.64 90 bottom
R23#40  -  [R0603]  48.73 56.72 90 bottom
R24  10K  [R0603]  79.6 82.77 90 top
R24#2  -  [R0603]  91.45 78.75 90 top
R24#3  -  [R0603]  55.91 78.75 90 top
R24#4  -  [R0603]  79.6 78.75 90 top
R24#5  -  [R0603]  91.45 74.94 90 top
R24#6  -  [R0603]  55.91 74.94 90 top
R24#7  -  [R0603]  79.6 74.94 90 top
R24#8  -  [R0603]  91.45 70.7 90 top
R24#9  -  [R0603]  55.91 70.7 90 top
R24#10  -  [R0603]  79.6 70.7 90 top
R24#11  -  [R0603]  91.45 66.15 90 top
R24#12  -  [R0603]  55.91 66.15 90 top
R24#13  -  [R0603]  79.6 66.15 90 top
R24#14  -  [R0603]  91.45 61.81 90 top
R24#15  -  [R0603]  55.91 61.81 90 top
R24#16  -  [R0603]  79.6 61.81 90 top
R24#17  -  [R0603]  91.45 56.78 90 top
R24#18  -  [R0603]  55.91 56.78 90 top
R24#19  -  [R0603]  79.6 56.78 90 top
R24#20  -  [R0603]  91.45 52.23 90 top
R24#21  -  [R0603]  55.91 52.23 90 top
R24#22  -  [R0603]  79.6 52.23 90 top
R24#23  -  [R0603]  55.91 91.95 90 top
R24#24  -  [R0603]  79.6 91.95 90 top
R24#25  -  [R0603]  91.45 91.95 90 top
R24#26  -  [R0603]  91.45 87.49 90 top
R24#27  -  [R0603]  55.91 87.49 90 top
R24#28  -  [R0603]  79.6 87.49 90 top
R24#29  -  [R0603]  91.45 82.77 90 top
R24#30  -  [R0603]  55.91 82.77 90 top
R24#31  -  [R0603]  55.84 70.64 90 bottom
R24#32  -  [R0603]  79.54 74.88 90 bottom
R24#33  -  [R0603]  55.84 91.89 90 bottom
R24#34  -  [R0603]  55.84 61.75 90 bottom
R24#35  -  [R0603]  55.84 56.72 90 bottom
R24#36  -  [R0603]  55.84 66.09 90 bottom
R24#37  -  [R0603]  79.54 91.89 90 bottom
R24#38  -  [R0603]  91.38 91.89 90 bottom
R24#39  -  [R0603]  55.84 87.43 90 bottom
R24#40  -  [R0603]  91.38 61.75 90 bottom
R24#41  -  [R0603]  55.84 78.69 90 bottom
R24#42  -  [R0603]  91.38 82.7 90 bottom
R24#43  -  [R0603]  55.84 82.7 90 bottom
R24#44  -  [R0603]  55.84 52.17 90 bottom
R24#45  -  [R0603]  91.38 87.43 90 bottom
R24#46  -  [R0603]  91.38 78.69 90 bottom
R24#47  -  [R0603]  79.54 82.7 90 bottom
R24#48  -  [R0603]  79.54 56.72 90 bottom
R24#49  -  [R0603]  79.54 61.75 90 bottom
R24#50  -  [R0603]  79.54 52.17 90 bottom
R24#51  -  [R0603]  91.38 52.17 90 bottom
R24#52  -  [R0603]  55.84 74.88 90 bottom
R24#53  -  [R0603]  79.54 87.43 90 bottom
R24#54  -  [R0603]  79.54 78.69 90 bottom
R24#55  -  [R0603]  79.54 66.09 90 bottom
R24#56  -  [R0603]  91.38 74.88 90 bottom
R24#57  -  [R0603]  91.38 66.09 90 bottom
R24#58  -  [R0603]  79.54 70.64 90 bottom
R24#59  -  [R0603]  91.38 70.64 90 bottom
R24#60  -  [R0603]  91.38 56.72 90 bottom
R25  10K  [R0603]  96.19 82.77 90 top
R25#2  -  [R0603]  60.65 82.77 90 top
R25#3  -  [R0603]  96.19 70.7 90 top
R25#4  -  [R0603]  84.34 78.75 90 top
R25#5  -  [R0603]  96.19 78.75 90 top
R25#6  -  [R0603]  60.65 78.75 90 top
R25#7  -  [R0603]  84.34 74.94 90 top
R25#8  -  [R0603]  96.19 74.94 90 top
R25#9  -  [R0603]  60.65 74.94 90 top
R25#10  -  [R0603]  84.34 70.7 90 top
R25#11  -  [R0603]  60.65 70.7 90 top
R25#12  -  [R0603]  84.34 66.15 90 top
R25#13  -  [R0603]  96.19 66.15 90 top
R25#14  -  [R0603]  60.65 66.15 90 top
R25#15  -  [R0603]  84.34 61.81 90 top
R25#16  -  [R0603]  96.19 61.81 90 top
R25#17  -  [R0603]  60.65 61.81 90 top
R25#18  -  [R0603]  84.34 56.78 90 top
R25#19  -  [R0603]  96.19 56.78 90 top
R25#20  -  [R0603]  60.65 56.78 90 top
R25#21  -  [R0603]  84.34 52.23 90 top
R25#22  -  [R0603]  96.19 52.23 90 top
R25#23  -  [R0603]  60.65 52.23 90 top
R25#24  -  [R0603]  60.65 91.95 90 top
R25#25  -  [R0603]  84.34 91.95 90 top
R25#26  -  [R0603]  96.19 91.95 90 top
R25#27  -  [R0603]  84.34 87.49 90 top
R25#28  -  [R0603]  96.19 87.49 90 top
R25#29  -  [R0603]  60.65 87.49 90 top
R25#30  -  [R0603]  84.34 82.77 90 top
R25#31  -  [R0603]  60.58 70.64 90 bottom
R25#32  -  [R0603]  84.28 74.88 90 bottom
R25#33  -  [R0603]  60.58 91.89 90 bottom
R25#34  -  [R0603]  60.58 61.75 90 bottom
R25#35  -  [R0603]  60.58 56.72 90 bottom
R25#36  -  [R0603]  60.58 87.43 90 bottom
R25#37  -  [R0603]  84.28 91.89 90 bottom
R25#38  -  [R0603]  96.12 91.89 90 bottom
R25#39  -  [R0603]  84.28 52.17 90 bottom
R25#40  -  [R0603]  96.12 82.7 90 bottom
R25#41  -  [R0603]  96.12 61.75 90 bottom
R25#42  -  [R0603]  84.28 82.7 90 bottom
R25#43  -  [R0603]  96.12 87.43 90 bottom
R25#44  -  [R0603]  60.58 82.7 90 bottom
R25#45  -  [R0603]  84.28 61.75 90 bottom
R25#46  -  [R0603]  96.12 78.69 90 bottom
R25#47  -  [R0603]  84.28 78.69 90 bottom
R25#48  -  [R0603]  96.12 74.88 90 bottom
R25#49  -  [R0603]  84.28 56.72 90 bottom
R25#50  -  [R0603]  96.12 56.72 90 bottom
R25#51  -  [R0603]  96.12 66.09 90 bottom
R25#52  -  [R0603]  60.58 78.69 90 bottom
R25#53  -  [R0603]  60.58 74.88 90 bottom
R25#54  -  [R0603]  60.58 52.17 90 bottom
R25#55  -  [R0603]  84.28 87.43 90 bottom
R25#56  -  [R0603]  84.28 66.09 90 bottom
R25#57  -  [R0603]  96.12 70.64 90 bottom
R25#58  -  [R0603]  84.28 70.64 90 bottom
R25#59  -  [R0603]  60.58 66.09 90 bottom
R25#60  -  [R0603]  96.12 52.17 90 bottom
R26  10K  [R0603]  86.71 82.77 90 top
R26#2  -  [R0603]  63.02 82.77 90 top
R26#3  -  [R0603]  98.56 82.77 90 top
R26#4  -  [R0603]  86.71 78.75 90 top
R26#5  -  [R0603]  63.02 78.75 90 top
R26#6  -  [R0603]  98.56 78.75 90 top
R26#7  -  [R0603]  86.71 74.94 90 top
R26#8  -  [R0603]  63.02 74.94 90 top
R26#9  -  [R0603]  98.56 74.94 90 top
R26#10  -  [R0603]  86.71 70.7 90 top
R26#11  -  [R0603]  63.02 70.7 90 top
R26#12  -  [R0603]  98.56 70.7 90 top
R26#13  -  [R0603]  86.71 66.15 90 top
R26#14  -  [R0603]  63.02 66.15 90 top
R26#15  -  [R0603]  98.56 66.15 90 top
R26#16  -  [R0603]  86.71 61.81 90 top
R26#17  -  [R0603]  63.02 61.81 90 top
R26#18  -  [R0603]  98.56 61.81 90 top
R26#19  -  [R0603]  86.71 56.78 90 top
R26#20  -  [R0603]  63.02 56.78 90 top
R26#21  -  [R0603]  98.56 56.78 90 top
R26#22  -  [R0603]  86.71 52.23 90 top
R26#23  -  [R0603]  63.02 52.23 90 top
R26#24  -  [R0603]  98.56 52.23 90 top
R26#25  -  [R0603]  63.02 91.95 90 top
R26#26  -  [R0603]  86.71 91.95 90 top
R26#27  -  [R0603]  98.56 91.95 90 top
R26#28  -  [R0603]  86.71 87.49 90 top
R26#29  -  [R0603]  63.02 87.49 90 top
R26#30  -  [R0603]  98.56 87.49 90 top
R26#31  -  [R0603]  98.49 61.75 90 bottom
R26#32  -  [R0603]  98.49 74.88 90 bottom
R26#33  -  [R0603]  62.95 87.43 90 bottom
R26#34  -  [R0603]  62.95 91.89 90 bottom
R26#35  -  [R0603]  98.49 66.09 90 bottom
R26#36  -  [R0603]  62.95 61.75 90 bottom
R26#37  -  [R0603]  62.95 56.72 90 bottom
R26#38  -  [R0603]  98.49 91.89 90 bottom
R26#39  -  [R0603]  86.64 91.89 90 bottom
R26#40  -  [R0603]  86.64 82.7 90 bottom
R26#41  -  [R0603]  62.95 52.17 90 bottom
R26#42  -  [R0603]  86.64 87.43 90 bottom
R26#43  -  [R0603]  62.95 82.7 90 bottom
R26#44  -  [R0603]  86.64 78.69 90 bottom
R26#45  -  [R0603]  86.64 61.75 90 bottom
R26#46  -  [R0603]  86.64 56.72 90 bottom
R26#47  -  [R0603]  86.64 52.17 90 bottom
R26#48  -  [R0603]  98.49 82.7 90 bottom
R26#49  -  [R0603]  98.49 87.43 90 bottom
R26#50  -  [R0603]  98.49 78.69 90 bottom
R26#51  -  [R0603]  98.49 70.64 90 bottom
R26#52  -  [R0603]  98.49 56.72 90 bottom
R26#53  -  [R0603]  98.49 52.17 90 bottom
R26#54  -  [R0603]  62.95 74.88 90 bottom
R26#55  -  [R0603]  62.95 66.09 90 bottom
R26#56  -  [R0603]  62.95 70.64 90 bottom
R26#57  -  [R0603]  86.64 66.09 90 bottom
R26#58  -  [R0603]  86.64 74.88 90 bottom
R26#59  -  [R0603]  86.64 70.64 90 bottom
R26#60  -  [R0603]  62.95 78.69 90 bottom
R27  10K  [R0603]  89.08 82.77 90 top
R27#2  -  [R0603]  53.54 78.75 90 top
R27#3  -  [R0603]  77.23 78.75 90 top
R27#4  -  [R0603]  89.08 78.75 90 top
R27#5  -  [R0603]  53.54 74.94 90 top
R27#6  -  [R0603]  77.23 74.94 90 top
R27#7  -  [R0603]  89.08 74.94 90 top
R27#8  -  [R0603]  53.54 70.7 90 top
R27#9  -  [R0603]  77.23 70.7 90 top
R27#10  -  [R0603]  89.08 70.7 90 top
R27#11  -  [R0603]  53.54 66.15 90 top
R27#12  -  [R0603]  77.23 66.15 90 top
R27#13  -  [R0603]  89.08 66.15 90 top
R27#14  -  [R0603]  53.54 61.81 90 top
R27#15  -  [R0603]  77.23 61.81 90 top
R27#16  -  [R0603]  89.08 61.81 90 top
R27#17  -  [R0603]  53.54 56.78 90 top
R27#18  -  [R0603]  77.23 56.78 90 top
R27#19  -  [R0603]  89.08 56.78 90 top
R27#20  -  [R0603]  53.54 52.23 90 top
R27#21  -  [R0603]  77.23 52.23 90 top
R27#22  -  [R0603]  89.08 52.23 90 top
R27#23  -  [R0603]  53.54 91.95 90 top
R27#24  -  [R0603]  77.23 91.95 90 top
R27#25  -  [R0603]  89.08 91.95 90 top
R27#26  -  [R0603]  53.54 87.49 90 top
R27#27  -  [R0603]  77.23 87.49 90 top
R27#28  -  [R0603]  89.08 87.49 90 top
R27#29  -  [R0603]  53.54 82.77 90 top
R27#30  -  [R0603]  77.23 82.77 90 top
R27#31  -  [R0603]  53.47 70.64 90 bottom
R27#32  -  [R0603]  89.01 52.17 90 bottom
R27#33  -  [R0603]  53.47 91.89 90 bottom
R27#34  -  [R0603]  53.47 61.75 90 bottom
R27#35  -  [R0603]  53.47 56.72 90 bottom
R27#36  -  [R0603]  53.47 78.69 90 bottom
R27#37  -  [R0603]  77.17 91.89 90 bottom
R27#38  -  [R0603]  89.01 91.89 90 bottom
R27#39  -  [R0603]  53.47 82.7 90 bottom
R27#40  -  [R0603]  53.47 87.43 90 bottom
R27#41  -  [R0603]  53.47 74.88 90 bottom
R27#42  -  [R0603]  89.01 87.43 90 bottom
R27#43  -  [R0603]  89.01 82.7 90 bottom
R27#44  -  [R0603]  53.47 52.17 90 bottom
R27#45  -  [R0603]  89.01 78.69 90 bottom
R27#46  -  [R0603]  77.17 82.7 90 bottom
R27#47  -  [R0603]  77.17 66.09 90 bottom
R27#48  -  [R0603]  77.17 61.75 90 bottom
R27#49  -  [R0603]  77.17 70.64 90 bottom
R27#50  -  [R0603]  89.01 56.72 90 bottom
R27#51  -  [R0603]  77.17 52.17 90 bottom
R27#52  -  [R0603]  77.17 56.72 90 bottom
R27#53  -  [R0603]  77.17 87.43 90 bottom
R27#54  -  [R0603]  77.17 78.69 90 bottom
R27#55  -  [R0603]  89.01 61.75 90 bottom
R27#56  -  [R0603]  89.01 66.09 90 bottom
R27#57  -  [R0603]  89.01 70.64 90 bottom
R27#58  -  [R0603]  89.01 74.88 90 bottom
R27#59  -  [R0603]  77.17 74.88 90 bottom
R27#60  -  [R0603]  53.47 66.09 90 bottom
R28  10K  [R0603]  70.12 82.77 90 top
R28#2  -  [R0603]  46.43 78.75 90 top
R28#3  -  [R0603]  70.12 78.75 90 top
R28#4  -  [R0603]  46.43 74.94 90 top
R28#5  -  [R0603]  70.12 74.94 90 top
R28#6  -  [R0603]  46.43 70.7 90 top
R28#7  -  [R0603]  70.12 70.7 90 top
R28#8  -  [R0603]  46.43 66.15 90 top
R28#9  -  [R0603]  70.12 66.15 90 top
R28#10  -  [R0603]  46.43 61.81 90 top
R28#11  -  [R0603]  70.12 61.81 90 top
R28#12  -  [R0603]  46.43 56.78 90 top
R28#13  -  [R0603]  70.12 56.78 90 top
R28#14  -  [R0603]  46.43 52.23 90 top
R28#15  -  [R0603]  70.12 52.23 90 top
R28#16  -  [R0603]  46.43 91.95 90 top
R28#17  -  [R0603]  70.12 91.95 90 top
R28#18  -  [R0603]  46.43 87.49 90 top
R28#19  -  [R0603]  70.12 87.49 90 top
R28#20  -  [R0603]  46.43 82.77 90 top
R28#21  -  [R0603]  70.06 70.64 90 bottom
R28#22  -  [R0603]  70.06 61.75 90 bottom
R28#23  -  [R0603]  70.06 56.72 90 bottom
R28#24  -  [R0603]  46.36 91.89 90 bottom
R28#25  -  [R0603]  70.06 91.89 90 bottom
R28#26  -  [R0603]  46.36 87.43 90 bottom
R28#27  -  [R0603]  46.36 52.17 90 bottom
R28#28  -  [R0603]  70.06 78.69 90 bottom
R28#29  -  [R0603]  46.36 74.88 90 bottom
R28#30  -  [R0603]  46.36 70.64 90 bottom
R28#31  -  [R0603]  70.06 82.7 90 bottom
R28#32  -  [R0603]  70.06 74.88 90 bottom
R28#33  -  [R0603]  70.06 52.17 90 bottom
R28#34  -  [R0603]  46.36 61.75 90 bottom
R28#35  -  [R0603]  46.36 82.7 90 bottom
R28#36  -  [R0603]  46.36 56.72 90 bottom
R28#37  -  [R0603]  46.36 66.09 90 bottom
R28#38  -  [R0603]  46.36 78.69 90 bottom
R28#39  -  [R0603]  70.06 87.43 90 bottom
R28#40  -  [R0603]  70.06 66.09 90 bottom
R29  10K  [R0603]  41.69 82.77 90 top
R29#2  -  [R0603]  65.39 78.75 90 top
R29#3  -  [R0603]  41.69 78.75 90 top
R29#4  -  [R0603]  65.39 74.94 90 top
R29#5  -  [R0603]  41.69 74.94 90 top
R29#6  -  [R0603]  65.39 70.7 90 top
R29#7  -  [R0603]  41.69 70.7 90 top
R29#8  -  [R0603]  65.39 66.15 90 top
R29#9  -  [R0603]  41.69 66.15 90 top
R29#10  -  [R0603]  65.39 61.81 90 top
R29#11  -  [R0603]  41.69 61.81 90 top
R29#12  -  [R0603]  65.39 56.78 90 top
R29#13  -  [R0603]  41.69 56.78 90 top
R29#14  -  [R0603]  65.39 52.23 90 top
R29#15  -  [R0603]  41.69 52.23 90 top
R29#16  -  [R0603]  41.69 91.95 90 top
R29#17  -  [R0603]  65.39 91.95 90 top
R29#18  -  [R0603]  65.39 87.49 90 top
R29#19  -  [R0603]  41.69 87.49 90 top
R29#20  -  [R0603]  65.39 82.77 90 top
R29#21  -  [R0603]  41.62 74.88 90 bottom
R29#22  -  [R0603]  65.32 61.75 90 bottom
R29#23  -  [R0603]  65.32 87.43 90 bottom
R29#24  -  [R0603]  41.62 61.75 90 bottom
R29#25  -  [R0603]  41.62 82.7 90 bottom
R29#26  -  [R0603]  41.62 87.43 90 bottom
R29#27  -  [R0603]  65.32 91.89 90 bottom
R29#28  -  [R0603]  41.62 56.72 90 bottom
R29#29  -  [R0603]  65.32 82.7 90 bottom
R29#30  -  [R0603]  65.32 56.72 90 bottom
R29#31  -  [R0603]  41.62 70.64 90 bottom
R29#32  -  [R0603]  41.62 78.69 90 bottom
R29#33  -  [R0603]  41.62 66.09 90 bottom
R29#34  -  [R0603]  41.62 52.17 90 bottom
R29#35  -  [R0603]  41.62 91.89 90 bottom
R29#36  -  [R0603]  65.32 66.09 90 bottom
R29#37  -  [R0603]  65.32 52.17 90 bottom
R29#38  -  [R0603]  65.32 70.64 90 bottom
R29#39  -  [R0603]  65.32 74.88 90 bottom
R29#40  -  [R0603]  65.32 78.69 90 bottom
R30  10K  [R0603]  74.86 82.77 90 top
R30#2  -  [R0603]  51.17 78.75 90 top
R30#3  -  [R0603]  74.86 78.75 90 top
R30#4  -  [R0603]  51.17 74.94 90 top
R30#5  -  [R0603]  74.86 74.94 90 top
R30#6  -  [R0603]  51.17 70.7 90 top
R30#7  -  [R0603]  74.86 70.7 90 top
R30#8  -  [R0603]  51.17 66.15 90 top
R30#9  -  [R0603]  74.86 66.15 90 top
R30#10  -  [R0603]  51.17 61.81 90 top
R30#11  -  [R0603]  74.86 61.81 90 top
R30#12  -  [R0603]  51.17 56.78 90 top
R30#13  -  [R0603]  74.86 56.78 90 top
R30#14  -  [R0603]  51.17 52.23 90 top
R30#15  -  [R0603]  74.86 52.23 90 top
R30#16  -  [R0603]  51.17 91.95 90 top
R30#17  -  [R0603]  74.86 91.95 90 top
R30#18  -  [R0603]  51.17 87.49 90 top
R30#19  -  [R0603]  74.86 87.49 90 top
R30#20  -  [R0603]  51.17 82.77 90 top
R30#21  -  [R0603]  51.1 91.89 90 bottom
R30#22  -  [R0603]  51.1 78.69 90 bottom
R30#23  -  [R0603]  51.1 61.75 90 bottom
R30#24  -  [R0603]  74.8 91.89 90 bottom
R30#25  -  [R0603]  51.1 82.7 90 bottom
R30#26  -  [R0603]  51.1 74.88 90 bottom
R30#27  -  [R0603]  51.1 70.64 90 bottom
R30#28  -  [R0603]  51.1 87.43 90 bottom
R30#29  -  [R0603]  51.1 56.72 90 bottom
R30#30  -  [R0603]  74.8 78.69 90 bottom
R30#31  -  [R0603]  74.8 74.88 90 bottom
R30#32  -  [R0603]  74.8 70.64 90 bottom
R30#33  -  [R0603]  74.8 82.7 90 bottom
R30#34  -  [R0603]  74.8 56.72 90 bottom
R30#35  -  [R0603]  74.8 87.43 90 bottom
R30#36  -  [R0603]  51.1 52.17 90 bottom
R30#37  -  [R0603]  74.8 52.17 90 bottom
R30#38  -  [R0603]  74.8 61.75 90 bottom
R30#39  -  [R0603]  74.8 66.09 90 bottom
R30#40  -  [R0603]  51.1 66.09 90 bottom
R31  10K  [R0603]  93.82 82.77 90 top
R31#2  -  [R0603]  58.28 82.77 90 top
R31#3  -  [R0603]  81.97 78.75 90 top
R31#4  -  [R0603]  93.82 78.75 90 top
R31#5  -  [R0603]  58.28 78.75 90 top
R31#6  -  [R0603]  81.97 74.94 90 top
R31#7  -  [R0603]  93.82 74.94 90 top
R31#8  -  [R0603]  58.28 74.94 90 top
R31#9  -  [R0603]  81.97 70.7 90 top
R31#10  -  [R0603]  93.82 70.7 90 top
R31#11  -  [R0603]  58.28 70.7 90 top
R31#12  -  [R0603]  81.97 66.15 90 top
R31#13  -  [R0603]  93.82 66.15 90 top
R31#14  -  [R0603]  58.28 66.15 90 top
R31#15  -  [R0603]  81.97 61.81 90 top
R31#16  -  [R0603]  93.82 61.81 90 top
R31#17  -  [R0603]  58.28 61.81 90 top
R31#18  -  [R0603]  81.97 56.78 90 top
R31#19  -  [R0603]  93.82 56.78 90 top
R31#20  -  [R0603]  58.28 56.78 90 top
R31#21  -  [R0603]  81.97 52.23 90 top
R31#22  -  [R0603]  93.82 52.23 90 top
R31#23  -  [R0603]  58.28 52.23 90 top
R31#24  -  [R0603]  58.28 91.95 90 top
R31#25  -  [R0603]  81.97 91.95 90 top
R31#26  -  [R0603]  93.82 91.95 90 top
R31#27  -  [R0603]  81.97 87.49 90 top
R31#28  -  [R0603]  93.82 87.49 90 top
R31#29  -  [R0603]  58.28 87.49 90 top
R31#30  -  [R0603]  81.97 82.77 90 top
R31#31  -  [R0603]  93.75 52.17 90 bottom
R31#32  -  [R0603]  93.75 70.64 90 bottom
R31#33  -  [R0603]  81.91 52.17 90 bottom
R31#34  -  [R0603]  58.21 91.89 90 bottom
R31#35  -  [R0603]  58.21 61.75 90 bottom
R31#36  -  [R0603]  58.21 56.72 90 bottom
R31#37  -  [R0603]  58.21 87.43 90 bottom
R31#38  -  [R0603]  81.91 91.89 90 bottom
R31#39  -  [R0603]  93.75 91.89 90 bottom
R31#40  -  [R0603]  93.75 87.43 90 bottom
R31#41  -  [R0603]  58.21 82.7 90 bottom
R31#42  -  [R0603]  93.75 61.75 90 bottom
R31#43  -  [R0603]  58.21 78.69 90 bottom
R31#44  -  [R0603]  58.21 70.64 90 bottom
R31#45  -  [R0603]  93.75 74.88 90 bottom
R31#46  -  [R0603]  81.91 61.75 90 bottom
R31#47  -  [R0603]  81.91 82.7 90 bottom
R31#48  -  [R0603]  93.75 82.7 90 bottom
R31#49  -  [R0603]  93.75 78.69 90 bottom
R31#50  -  [R0603]  93.75 66.09 90 bottom
R31#51  -  [R0603]  93.75 56.72 90 bottom
R31#52  -  [R0603]  81.91 56.72 90 bottom
R31#53  -  [R0603]  58.21 74.88 90 bottom
R31#54  -  [R0603]  58.21 52.17 90 bottom
R31#55  -  [R0603]  81.91 78.69 90 bottom
R31#56  -  [R0603]  81.91 87.43 90 bottom
R31#57  -  [R0603]  81.91 66.09 90 bottom
R31#58  -  [R0603]  81.91 74.88 90 bottom
R31#59  -  [R0603]  81.91 70.64 90 bottom
R31#60  -  [R0603]  58.21 66.09 90 bottom
R32  10K  [R0805]  6.06 87.08 270 top
R32#2  -  [R0805]  6.06 82.08 270 top
R32#3  -  [R0805]  6.06 77.09 270 top
R32#4  -  [R0805]  6.06 72.09 270 top
R32#5  -  [R0805]  6.06 67.09 270 top
R32#6  -  [R0805]  6.06 62.1 270 top
R32#7  -  [R0805]  6.06 57.1 270 top
R32#8  -  [R0805]  6.06 52.1 270 top
R32#9  -  [R0805]  6.06 92.08 270 top
R32#10  -  [R0805]  6 62.03 270 bottom
R32#11  -  [R0805]  6 67.03 270 bottom
R32#12  -  [R0805]  6 77.02 270 bottom
R32#13  -  [R0805]  6 82.02 270 bottom
R32#14  -  [R0805]  6 72.03 270 bottom
R32#15  -  [R0805]  6 52.04 270 bottom
R32#16  -  [R0805]  6 57.04 270 bottom
R32#17  -  [R0805]  6 87.02 270 bottom
R32#18  -  [R0805]  6 92.01 270 bottom
R33  10K  [R0805]  17.92 87.08 90 top
R33#2  -  [R0805]  17.92 82.08 90 top
R33#3  -  [R0805]  17.92 77.09 90 top
R33#4  -  [R0805]  17.92 72.09 90 top
R33#5  -  [R0805]  17.92 67.09 90 top
R33#6  -  [R0805]  17.92 62.1 90 top
R33#7  -  [R0805]  17.92 57.1 90 top
R33#8  -  [R0805]  17.92 52.1 90 top
R33#9  -  [R0805]  17.92 92.08 90 top
R33#10  -  [R0805]  17.85 52.04 90 bottom
R33#11  -  [R0805]  17.85 67.03 90 bottom
R33#12  -  [R0805]  17.85 62.03 90 bottom
R33#13  -  [R0805]  17.85 72.03 90 bottom
R33#14  -  [R0805]  17.85 77.02 90 bottom
R33#15  -  [R0805]  17.85 57.04 90 bottom
R33#16  -  [R0805]  17.85 82.02 90 bottom
R33#17  -  [R0805]  17.85 87.02 90 bottom
R33#18  -  [R0805]  17.85 92.01 90 bottom
R34  10K  [R0805]  21.87 87.08 90 top
R34#2  -  [R0805]  21.87 82.08 90 top
R34#3  -  [R0805]  21.87 77.09 90 top
R34#4  -  [R0805]  21.87 72.09 90 top
R34#5  -  [R0805]  21.87 67.09 90 top
R34#6  -  [R0805]  21.87 62.1 90 top
R34#7  -  [R0805]  21.87 57.1 90 top
R34#8  -  [R0805]  21.87 52.1 90 top
R34#9  -  [R0805]  21.87 92.08 90 top
R34#10  -  [R0805]  21.8 52.04 90 bottom
R34#11  -  [R0805]  21.8 72.03 90 bottom
R34#12  -  [R0805]  21.8 77.02 90 bottom
R34#13  -  [R0805]  21.8 92.01 90 bottom
R34#14  -  [R0805]  21.8 57.04 90 bottom
R34#15  -  [R0805]  21.8 82.02 90 bottom
R34#16  -  [R0805]  21.8 87.02 90 bottom
R34#17  -  [R0805]  21.8 62.03 90 bottom
R34#18  -  [R0805]  21.8 67.03 90 bottom
R35  10K  [R0805]  2.11 87.08 90 top
R35#2  -  [R0805]  2.11 82.08 90 top
R35#3  -  [R0805]  2.11 77.09 90 top
R35#4  -  [R0805]  2.11 72.09 90 top
R35#5  -  [R0805]  2.11 67.09 90 top
R35#6  -  [R0805]  2.11 62.1 90 top
R35#7  -  [R0805]  2.11 57.1 90 top
R35#8  -  [R0805]  2.11 52.1 90 top
R35#9  -  [R0805]  2.11 92.08 90 top
R35#10  -  [R0805]  2.04 62.03 90 bottom
R35#11  -  [R0805]  2.04 67.03 90 bottom
R35#12  -  [R0805]  2.04 57.04 90 bottom
R35#13  -  [R0805]  2.04 52.04 90 bottom
R35#14  -  [R0805]  2.04 77.02 90 bottom
R35#15  -  [R0805]  2.04 72.03 90 bottom
R35#16  -  [R0805]  2.04 87.02 90 bottom
R35#17  -  [R0805]  2.04 82.02 90 bottom
R35#18  -  [R0805]  2.04 92.01 90 bottom
R36  10K  [R0805]  33.72 87.08 90 top
R36#2  -  [R0805]  33.72 82.08 90 top
R36#3  -  [R0805]  33.72 77.09 90 top
R36#4  -  [R0805]  33.72 72.09 90 top
R36#5  -  [R0805]  33.72 67.09 90 top
R36#6  -  [R0805]  33.72 62.1 90 top
R36#7  -  [R0805]  33.72 57.1 90 top
R36#8  -  [R0805]  33.72 52.1 90 top
R36#9  -  [R0805]  33.72 92.08 90 top
R36#10  -  [R0805]  33.65 87.02 90 bottom
R36#11  -  [R0805]  33.65 67.03 90 bottom
R36#12  -  [R0805]  33.65 82.02 90 bottom
R36#13  -  [R0805]  33.65 92.01 90 bottom
R36#14  -  [R0805]  33.65 52.04 90 bottom
R36#15  -  [R0805]  33.65 62.03 90 bottom
R36#16  -  [R0805]  33.65 57.04 90 bottom
R36#17  -  [R0805]  33.65 72.03 90 bottom
R36#18  -  [R0805]  33.65 77.02 90 bottom
R37  10K  [R0805]  37.67 87.08 90 top
R37#2  -  [R0805]  37.67 82.08 90 top
R37#3  -  [R0805]  37.67 77.09 90 top
R37#4  -  [R0805]  37.67 72.09 90 top
R37#5  -  [R0805]  37.67 67.09 90 top
R37#6  -  [R0805]  37.67 62.1 90 top
R37#7  -  [R0805]  37.67 57.1 90 top
R37#8  -  [R0805]  37.67 52.1 90 top
R37#9  -  [R0805]  37.67 92.08 90 top
R37#10  -  [R0805]  37.6 92.01 90 bottom
R37#11  -  [R0805]  37.6 62.03 90 bottom
R37#12  -  [R0805]  37.6 77.02 90 bottom
R37#13  -  [R0805]  37.6 72.03 90 bottom
R37#14  -  [R0805]  37.6 67.03 90 bottom
R37#15  -  [R0805]  37.6 87.02 90 bottom
R37#16  -  [R0805]  37.6 82.02 90 bottom
R37#17  -  [R0805]  37.6 52.04 90 bottom
R37#18  -  [R0805]  37.6 57.04 90 bottom
R38  10K  [R0805]  10.01 52.1 90 top
R38#2  -  [R0805]  10.01 87.08 90 top
R38#3  -  [R0805]  10.01 82.08 90 top
R38#4  -  [R0805]  10.01 77.09 90 top
R38#5  -  [R0805]  10.01 72.09 90 top
R38#6  -  [R0805]  10.01 67.09 90 top
R38#7  -  [R0805]  10.01 62.1 90 top
R38#8  -  [R0805]  10.01 57.1 90 top
R38#9  -  [R0805]  10.01 92.08 90 top
R38#10  -  [R0805]  9.95 57.04 90 bottom
R38#11  -  [R0805]  9.95 67.03 90 bottom
R38#12  -  [R0805]  9.95 62.03 90 bottom
R38#13  -  [R0805]  9.95 82.02 90 bottom
R38#14  -  [R0805]  9.95 77.02 90 bottom
R38#15  -  [R0805]  9.95 72.03 90 bottom
R38#16  -  [R0805]  9.95 52.04 90 bottom
R38#17  -  [R0805]  9.95 87.02 90 bottom
R38#18  -  [R0805]  9.95 92.01 90 bottom
R39  10K  [R0805]  13.96 87.08 90 top
R39#2  -  [R0805]  13.96 82.08 90 top
R39#3  -  [R0805]  13.96 77.09 90 top
R39#4  -  [R0805]  13.96 72.09 90 top
R39#5  -  [R0805]  13.96 67.09 90 top
R39#6  -  [R0805]  13.96 62.1 90 top
R39#7  -  [R0805]  13.96 57.1 90 top
R39#8  -  [R0805]  13.96 52.1 90 top
R39#9  -  [R0805]  13.96 92.08 90 top
R39#10  -  [R0805]  13.9 62.03 90 bottom
R39#11  -  [R0805]  13.9 67.03 90 bottom
R39#12  -  [R0805]  13.9 52.04 90 bottom
R39#13  -  [R0805]  13.9 57.04 90 bottom
R39#14  -  [R0805]  13.9 72.03 90 bottom
R39#15  -  [R0805]  13.9 82.02 90 bottom
R39#16  -  [R0805]  13.9 77.02 90 bottom
R39#17  -  [R0805]  13.9 87.02 90 bottom
R39#18  -  [R0805]  13.9 92.01 90 bottom
R40  10K  [R0805]  25.82 87.08 90 top
R40#2  -  [R0805]  25.82 82.08 90 top
R40#3  -  [R0805]  25.82 77.09 90 top
R40#4  -  [R0805]  25.82 72.09 90 top
